# Altium schematic sheet HDN_Control_Data.SchDoc
size A4; Organization: Creotech Instruments; Address1: Gen. L. Okulickiego 7/9; Address2: 05-500 Piaseczno; Address3: Poland
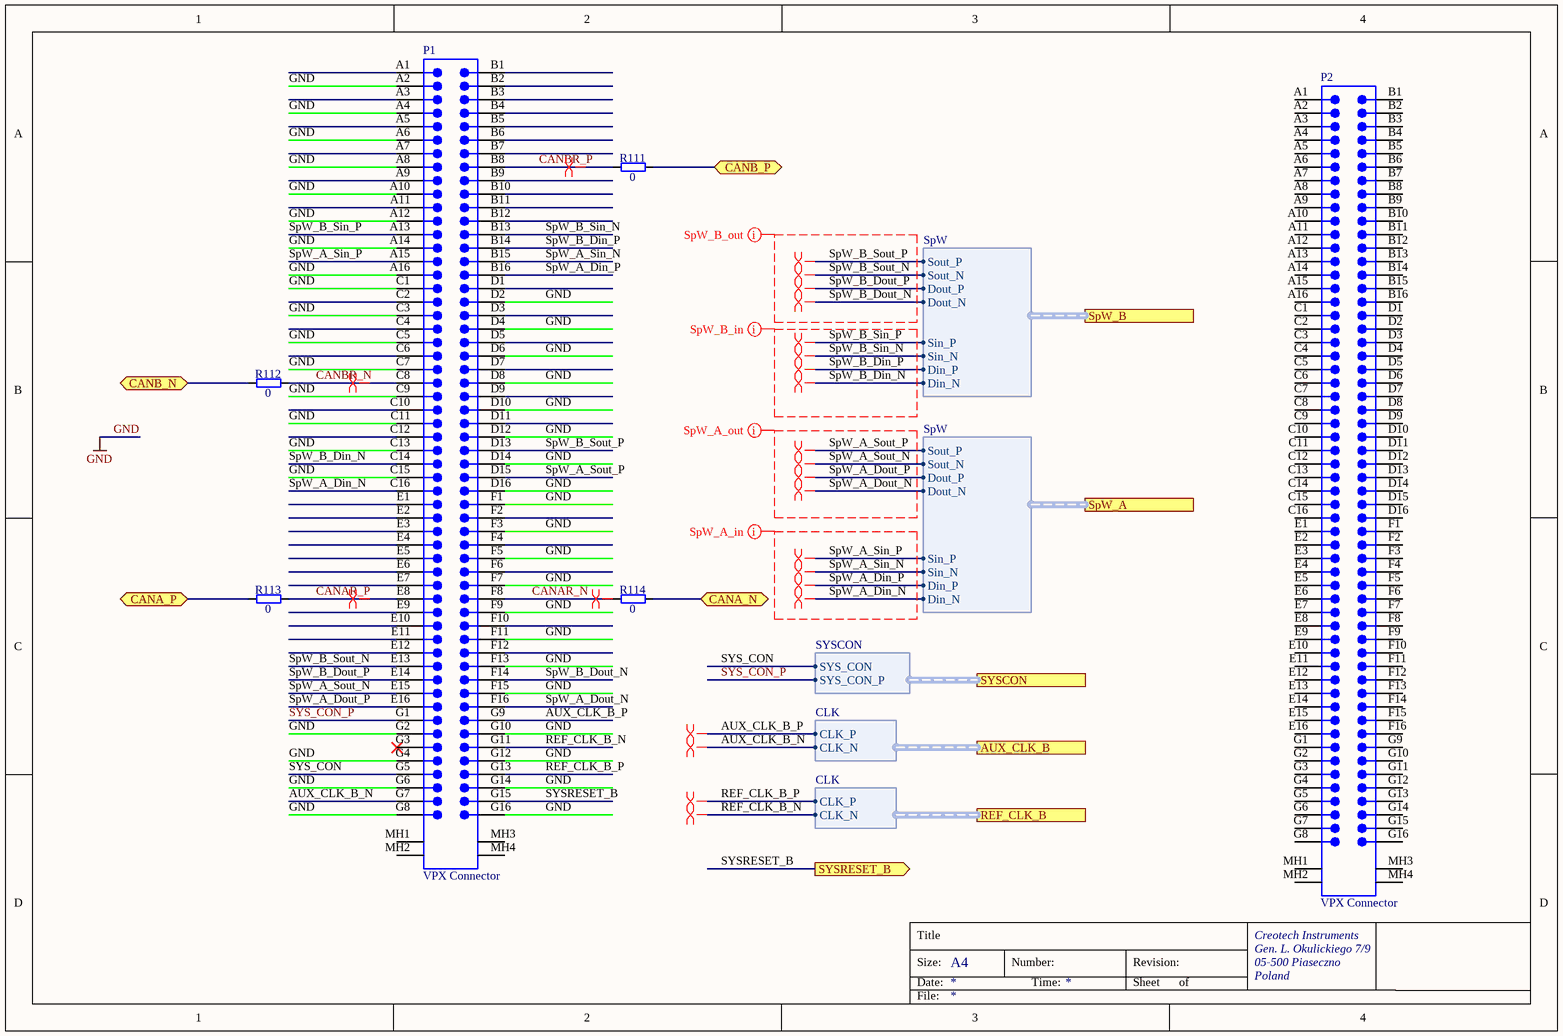
[diagram p0: HDN_Control_Data.SchDoc]

## Parts
P1  VPX Connector  [BTB1-8-4H112M]
P2  VPX Connector  [BTB1-8-4H112M]
R111  0  [RESC1608X55N]
R112  0  [RESC1608X55N]
R113  0  [RESC1608X55N]
R114  0  [RESC1608X55N]

## Ports
AUX_CLK_B (harness CLK), CANA_N (bidir), CANA_P (bidir), CANB_N (bidir), CANB_P (bidir), REF_CLK_B (harness CLK), SpW_A (harness SpW), SpW_B (harness SpW), SYSCON (harness SYSCON), SYSRESET_B (out)

## Harnesses
CLK: CLK_P, CLK_N
SYSCON: SYS_CON, SYS_CON_P
SpW: Sout_P, Sout_N, Dout_P, Dout_N, Sin_P, Sin_N, Din_P, Din_N

## Nets
GND: P1.A2 P1.A4 P1.A6 P1.A8 P1.A10 P1.A12 P1.A14 P1.A16 P1.C1 P1.C3 P1.C5 P1.C7 P1.C9 P1.C11 P1.C13 P1.C15 P1.D2 P1.D4 P1.D6 P1.D8 P1.D10 P1.D12 P1.D14 P1.D16 P1.F1 P1.F3 P1.F5 P1.F7 P1.F9 P1.F11 P1.F13 P1.F15 P1.G2 P1.G4 P1.G6 P1.G8 P1.G10 P1.G12 P1.G14 P1.G16
AUX_CLK_B_N: P1.G7 ; port AUX_CLK_B.CLK_N
AUX_CLK_B_P: P1.G9 ; port AUX_CLK_B.CLK_P
CANA_N: R114.2 ; port CANA_N
CANA_P: R113.1 ; port CANA_P
CANAR_N: P1.F8 R114.1
CANAR_P: P1.E8 R113.2
CANB_N: R112.1 ; port CANB_N
CANB_P: R111.2 ; port CANB_P
CANBR_N: P1.C8 R112.2
CANBR_P: P1.B8 R111.1
REF_CLK_B_N: P1.G11 ; port REF_CLK_B.CLK_N
REF_CLK_B_P: P1.G13 ; port REF_CLK_B.CLK_P
SpW_A_Din_N: P1.C16 ; port SpW_A.Din_N
SpW_A_Din_P: P1.B16 ; port SpW_A.Din_P
SpW_A_Dout_N: P1.F16 ; port SpW_A.Dout_N
SpW_A_Dout_P: P1.E16 ; port SpW_A.Dout_P
SpW_A_Sin_N: P1.B15 ; port SpW_A.Sin_N
SpW_A_Sin_P: P1.A15 ; port SpW_A.Sin_P
SpW_A_Sout_N: P1.E15 ; port SpW_A.Sout_N
SpW_A_Sout_P: P1.D15 ; port SpW_A.Sout_P
SpW_B_Din_N: P1.C14 ; port SpW_B.Din_N
SpW_B_Din_P: P1.B14 ; port SpW_B.Din_P
SpW_B_Dout_N: P1.F14 ; port SpW_B.Dout_N
SpW_B_Dout_P: P1.E14 ; port SpW_B.Dout_P
SpW_B_Sin_N: P1.B13 ; port SpW_B.Sin_N
SpW_B_Sin_P: P1.A13 ; port SpW_B.Sin_P
SpW_B_Sout_N: P1.E13 ; port SpW_B.Sout_N
SpW_B_Sout_P: P1.D13 ; port SpW_B.Sout_P
SYS_CON: P1.G5 ; port SYSCON.SYS_CON
SYS_CON_P: P1.G1 ; port SYSCON.SYS_CON_P
SYSRESET_B: P1.G15 ; port SYSRESET_B

Not connected (* = marked no-connect by the designer): P1 A1 A3 A5 A7 A9 A11 B1 B2 B3 B4 B5 B6 B7 B9 B10 B11 B12 C2 C4 C6 C10 C12 D1 D3 D5 D7 D9 D11 E1 E2 E3 E4 E5 E6 E7 E9 E10 E11 E12 F2 F4 F6 F10 F12 G3* MH1 MH2 MH3 MH4; P2 A1 A2 A3 A4 A5 A6 A7 A8 A9 A10 A11 A12 A13 A14 A15 A16 B1 B2 B3 B4 B5 B6 B7 B8 B9 B10 B11 B12 B13 B14 B15 B16 C1 C2 C3 C4 C5 C6 C7 C8 C9 C10 C11 C12 C13 C14 C15 C16 D1 D2 D3 D4 D5 D6 D7 D8 D9 D10 D11 D12 D13 D14 D15 D16 E1 E2 E3 E4 E5 E6 E7 E8 E9 E10 E11 E12 E13 E14 E15 E16 F1 F2 F3 F4 F5 F6 F7 F8 F9 F10 F11 F12 F13 F14 F15 F16 G1 G2 G3 G4 G5 G6 G7 G8 G9 G10 G11 G12 G13 G14 G15 G16 MH1 MH2 MH3 MH4

## Layout directives
differential pair: AUX_CLK_B_N, AUX_CLK_B_P, CANAR_N, CANAR_P, CANBR_N, CANBR_P, REF_CLK_B_N, REF_CLK_B_P, SpW_A_Din_N, SpW_A_Din_P, SpW_A_Dout_N, SpW_A_Dout_P, SpW_A_Sin_N, SpW_A_Sin_P, SpW_A_Sout_N, SpW_A_Sout_P, SpW_B_Din_N, SpW_B_Din_P, SpW_B_Dout_N, SpW_B_Dout_P, SpW_B_Sin_N, SpW_B_Sin_P, SpW_B_Sout_N, SpW_B_Sout_P
net class SpW_B_out: SpW_B_Dout_N, SpW_B_Dout_P, SpW_B_Sout_N, SpW_B_Sout_P
net class SpW_B_in: SpW_B_Din_N, SpW_B_Din_P, SpW_B_Sin_N, SpW_B_Sin_P
net class SpW_A_out: SpW_A_Dout_N, SpW_A_Dout_P, SpW_A_Sout_N, SpW_A_Sout_P
net class SpW_A_in: SpW_A_Din_N, SpW_A_Din_P, SpW_A_Sin_N, SpW_A_Sin_P

## Notes on the sheet
- Title
- Size:
- Date:
- A4
- Number:
- Time:
- Revision:
- Sheet
- of
- File:

## Library data of the parts
P1 P2 = CON_VPX_1410187-3: Board-to-Board Connector, Right Angle, 7-Row, Pitch 1.8mm, 112-Position; Manufacturer: TE; Bonding: No; ComponentHeigth: 14.7mm; PressFit: No; Case: *; Component Kind: Standard; Component Type: Standard; CreateDate: 2018-01-01; Device: *; Footprint: *; HelpURL: *; LatestRevisionDate: 2018-01-01; Manufacturer Part Number: 1410187-3; Mounted: Yes; PackageDescription: 1410187-3; Part Description: Board-to-Board Connector, Right Angle, 7-Row, Pitch 1.8mm, 112-Position; Part Number: 1410187-3; Pin Count: *; Sense: No; SMD: Yes; Socket: No; Family: VPX Connector
R111-R114 = R0603_0R_JUMPER: Resistor; Part Description: 1A (0.05R Max DC Resistance) Zero Ohm Jumper; Manufacturer: GENERIC; Manufacturer1 Part Number: NRC06Z0; PressFit: No; Mounted: No; Part Number: R0603_0R_JUMPER; Component Kind: Standard; Component Type: Standard; Pin Count: 2; Value: 0; Status: Preferred; Manufacturer Part Number: R0603_0R_JUMPER; Case: 0603; Sense: No; Socket: No; SMD: Yes; Manufacturer1 Example: NIC COMPONENT; Manufacturer1 ComponentHeight: 0.55mm; HelpURL: \\cern.ch\dfs\Applications\Altium\Datasheets\R0603_NIC_NRC.pdf; Author: CERN DEM JLC; CreateDate: 03.12.2007; LatestRevisionDate: 13.03.2008